# Altium schematic sheet Steering Wheel.SchDoc (part 1 of 2)
size A4; SheetNumber: 1
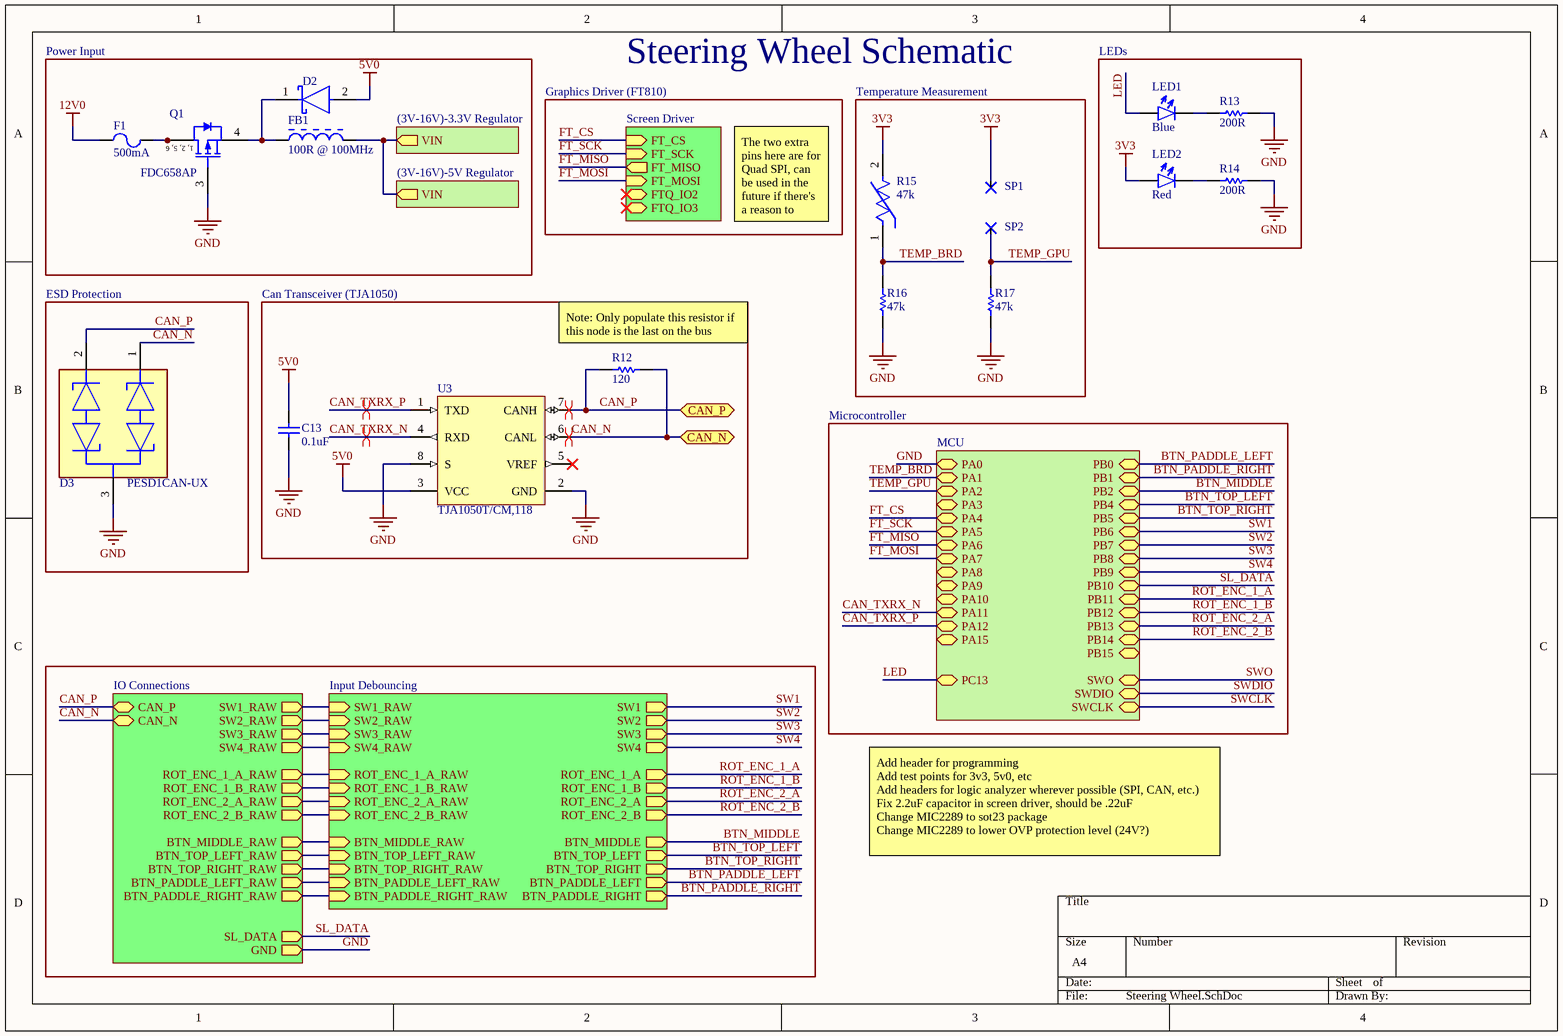
[diagram p0: Steering Wheel.SchDoc]

## Parts
C13  0.1uF  [CAPC2013X88X50NL20T25]
D2  (no value)  [FP-95400-MFG]
D3  PESD1CAN-UX  [FP-SOT323-MFG]
F1  500mA  [LFUS-0452_V]
FB1  100R @ 100MHz  [MURA-BLM18PG_KG-B25-CHIP-2_V1]
LED1  Blue  [0805]
LED2  Red  [0805]
Q1  FDC658AP  [FAIR-SOT23-6_V]
R12  120  [RESC2013X70X40NL20T20]
R13  200R  [0805]
R14  200R  [0805]
R15  47k  [FP-NCP21-0_2-IPC_B]
R16  47k  [RESC2013X70X40ML20T20]
R17  47k  [RESC2013X70X40ML20T20]
SP1  Rectangular  [2.5x5mm]  (value not drawn)
SP2  Rectangular  [2.5x5mm]  (value not drawn)
U3  TJA1050T/CM,118  [NXP-SOT96-1_M]

## Blocks framed on the sheet
Power Input: D2 F1 FB1 Q1
LEDs: LED1 LED2 R13 R14
Temperature Measurement: R15-R17 SP1 SP2
ESD Protection: D3
Can Transceiver (TJA1050): C13 R12 U3

## Sub-sheets
Input Debouncing = Input Debouncing.SchDoc: SW1 (out), SW2 (out), SW3 (out), SW4 (out), SW1_RAW (in), SW2_RAW (in), SW3_RAW (in), SW4_RAW (in), BTN_MIDDLE_RAW (in), BTN_TOP_LEFT_RAW (in), BTN_TOP_RIGHT_RAW (in), BTN_PADDLE_LEFT_RAW (in), BTN_PADDLE_RIGHT_RAW (in), ROT_ENC_1_A_RAW (in), ROT_ENC_2_A_RAW (in), ROT_ENC_2_B_RAW (in), ROT_ENC_1_B_RAW (in), BTN_MIDDLE (out), BTN_TOP_LEFT (out), BTN_TOP_RIGHT (out), BTN_PADDLE_LEFT (out), BTN_PADDLE_RIGHT (out), ROT_ENC_2_A (out), ROT_ENC_2_B (out), ROT_ENC_1_B (out), ROT_ENC_1_A (out)
IO Connections = IO Connections.SchDoc: SW1_RAW (out), SW2_RAW (out), SW3_RAW (out), SW4_RAW (out), CAN_P (bidir), CAN_N (bidir), SL_DATA (out), BTN_MIDDLE_RAW (out), BTN_TOP_LEFT_RAW (out), BTN_TOP_RIGHT_RAW (out), BTN_PADDLE_LEFT_RAW (out), BTN_PADDLE_RIGHT_RAW (out), ROT_ENC_1_A_RAW (out), ROT_ENC_1_B_RAW (out), ROT_ENC_2_A_RAW (out), ROT_ENC_2_B_RAW (out), GND (out)
MCU = STM32F103C8T6: PA15 (bidir), PB12 (bidir), PB13 (bidir), PB14 (bidir), PB15 (bidir), PB11 (bidir), PB4 (bidir), PB5 (bidir), PB6 (bidir), PB7 (bidir), PB8 (bidir), PB9 (bidir), PB10 (bidir), PB2 (bidir), PB0 (bidir), PB1 (bidir), PA9 (bidir), PA7 (bidir), PA6 (bidir), PA5 (bidir), PA4 (bidir), PA0 (bidir), PA1 (bidir), PA2 (bidir), PA3 (bidir), PA8 (bidir), PA10 (bidir), PA12 (bidir), PA11 (bidir), PC13 (bidir), SWDIO (bidir), SWCLK (bidir), SWO (bidir)
PSU_3V3 = (3V-16V)-3.3V Regulator: VIN (out)
PSU_5V0 = (3V-16V)-5V Regulator: VIN (out)
Screen Driver = Screen Driver.SchDoc: FT_SCK (in), FT_MOSI (in), FT_MISO (out), FTQ_IO2 (bidir), FTQ_IO3 (bidir), FT_CS (in)

## Ports
CAN_N (bidir), CAN_P (bidir)

## Nets
3V3: LED2.1 R15.2 SP1.1
5V0: C13.2 D2.2(A) U3.3(VCC)
12V0: F1.1
GND: C13.1 D3.3(common_cathode) Q1.3(GATE) R13.2 R14.2 R16.1 R17.1 U3.2(GND) U3.8(S) ; sheet IO Connections/GND, sheet MCU/PA0
BTN_MIDDLE: sheet Input Debouncing/BTN_MIDDLE, sheet MCU/PB2
BTN_PADDLE_LEFT: sheet Input Debouncing/BTN_PADDLE_LEFT, sheet MCU/PB0
BTN_PADDLE_RIGHT: sheet Input Debouncing/BTN_PADDLE_RIGHT, sheet MCU/PB1
BTN_TOP_LEFT: sheet Input Debouncing/BTN_TOP_LEFT, sheet MCU/PB4
BTN_TOP_RIGHT: sheet Input Debouncing/BTN_TOP_RIGHT, sheet MCU/PB5
CAN_N: D3.1(cathode_1) R12.2 U3.6(CANL) ; port CAN_N, sheet IO Connections/CAN_N
CAN_P: D3.2(cathode_2) R12.1 U3.7(CANH) ; port CAN_P, sheet IO Connections/CAN_P
CAN_TXRX_N: U3.4(RXD) ; sheet MCU/PA11
CAN_TXRX_P: U3.1(TXD) ; sheet MCU/PA12
FT_CS: sheet Screen Driver/FT_CS, sheet MCU/PA4
FT_MISO: sheet Screen Driver/FT_MISO, sheet MCU/PA6
FT_MOSI: sheet Screen Driver/FT_MOSI, sheet MCU/PA7
FT_SCK: sheet Screen Driver/FT_SCK, sheet MCU/PA5
LED: LED1.1 ; sheet MCU/PC13
ROT_ENC_1_A: sheet Input Debouncing/ROT_ENC_1_A, sheet MCU/PB11
ROT_ENC_1_B: sheet Input Debouncing/ROT_ENC_1_B, sheet MCU/PB12
ROT_ENC_2_A: sheet Input Debouncing/ROT_ENC_2_A, sheet MCU/PB13
ROT_ENC_2_B: sheet Input Debouncing/ROT_ENC_2_B, sheet MCU/PB14
SL_DATA: sheet IO Connections/SL_DATA, sheet MCU/PB10
SW1: sheet Input Debouncing/SW1, sheet MCU/PB6
SW2: sheet Input Debouncing/SW2, sheet MCU/PB7
SW3: sheet Input Debouncing/SW3, sheet MCU/PB8
SW4: sheet Input Debouncing/SW4, sheet MCU/PB9
SWCLK: sheet MCU/SWCLK
SWDIO: sheet MCU/SWDIO
SWO: sheet MCU/SWO
TEMP_BRD: R15.1 R16.2 ; sheet MCU/PA1
TEMP_GPU: R17.2 SP2.1 ; sheet MCU/PA2
NetD2_1: D2.1(C) FB1.1 Q1.4(SOURCE)
NetF1_2: F1.2 Q1.1(DRAIN) Q1.2(DRAIN) Q1.5(DRAIN) Q1.6(DRAIN)
NetFB1_2: FB1.2 ; sheet PSU_3V3/VIN, sheet PSU_5V0/VIN
NetLED1_2: LED1.2 R13.1
NetLED2_2: LED2.2 R14.1
(unnamed): sheet Input Debouncing/SW1_RAW, sheet IO Connections/SW1_RAW
(unnamed): sheet Input Debouncing/SW2_RAW, sheet IO Connections/SW2_RAW
(unnamed): sheet Input Debouncing/SW3_RAW, sheet IO Connections/SW3_RAW
(unnamed): sheet Input Debouncing/SW4_RAW, sheet IO Connections/SW4_RAW
(unnamed): sheet Input Debouncing/BTN_MIDDLE_RAW, sheet IO Connections/BTN_MIDDLE_RAW
(unnamed): sheet Input Debouncing/BTN_TOP_LEFT_RAW, sheet IO Connections/BTN_TOP_LEFT_RAW
(unnamed): sheet Input Debouncing/BTN_TOP_RIGHT_RAW, sheet IO Connections/BTN_TOP_RIGHT_RAW
(unnamed): sheet Input Debouncing/BTN_PADDLE_LEFT_RAW, sheet IO Connections/BTN_PADDLE_LEFT_RAW
(unnamed): sheet Input Debouncing/BTN_PADDLE_RIGHT_RAW, sheet IO Connections/BTN_PADDLE_RIGHT_RAW
(unnamed): sheet Input Debouncing/ROT_ENC_1_A_RAW, sheet IO Connections/ROT_ENC_1_A_RAW
(unnamed): sheet Input Debouncing/ROT_ENC_2_A_RAW, sheet IO Connections/ROT_ENC_2_A_RAW
(unnamed): sheet Input Debouncing/ROT_ENC_2_B_RAW, sheet IO Connections/ROT_ENC_2_B_RAW
(unnamed): sheet Input Debouncing/ROT_ENC_1_B_RAW, sheet IO Connections/ROT_ENC_1_B_RAW

Not connected (* = marked no-connect by the designer): U3 5(VREF)*

## Layout directives
differential pair: CAN_N, CAN_P, CAN_TXRX_N, CAN_TXRX_P

## Notes on the sheet
- Graphics Driver (FT810)
- Steering Wheel Schematic
- The two extra pins here are for Quad SPI, can be used in the future if there's a reason to
- (near R12) Note: Only populate this resistor if this node is the last on the bus
- Microcontroller
- Add header for programming
  Add test points for 3v3, 5v0, etc
  Add headers for logic analyzer wherever possible (SPI, CAN, etc.)
  Fix 2.2uF capacitor in screen driver, should be .22uF
  Change MIC2289 to sot23 package
  Change MIC2289 to lower OVP protection level (24V?)
- (in symbol CMP-2000-06244-1) 1, 2, 5, 6